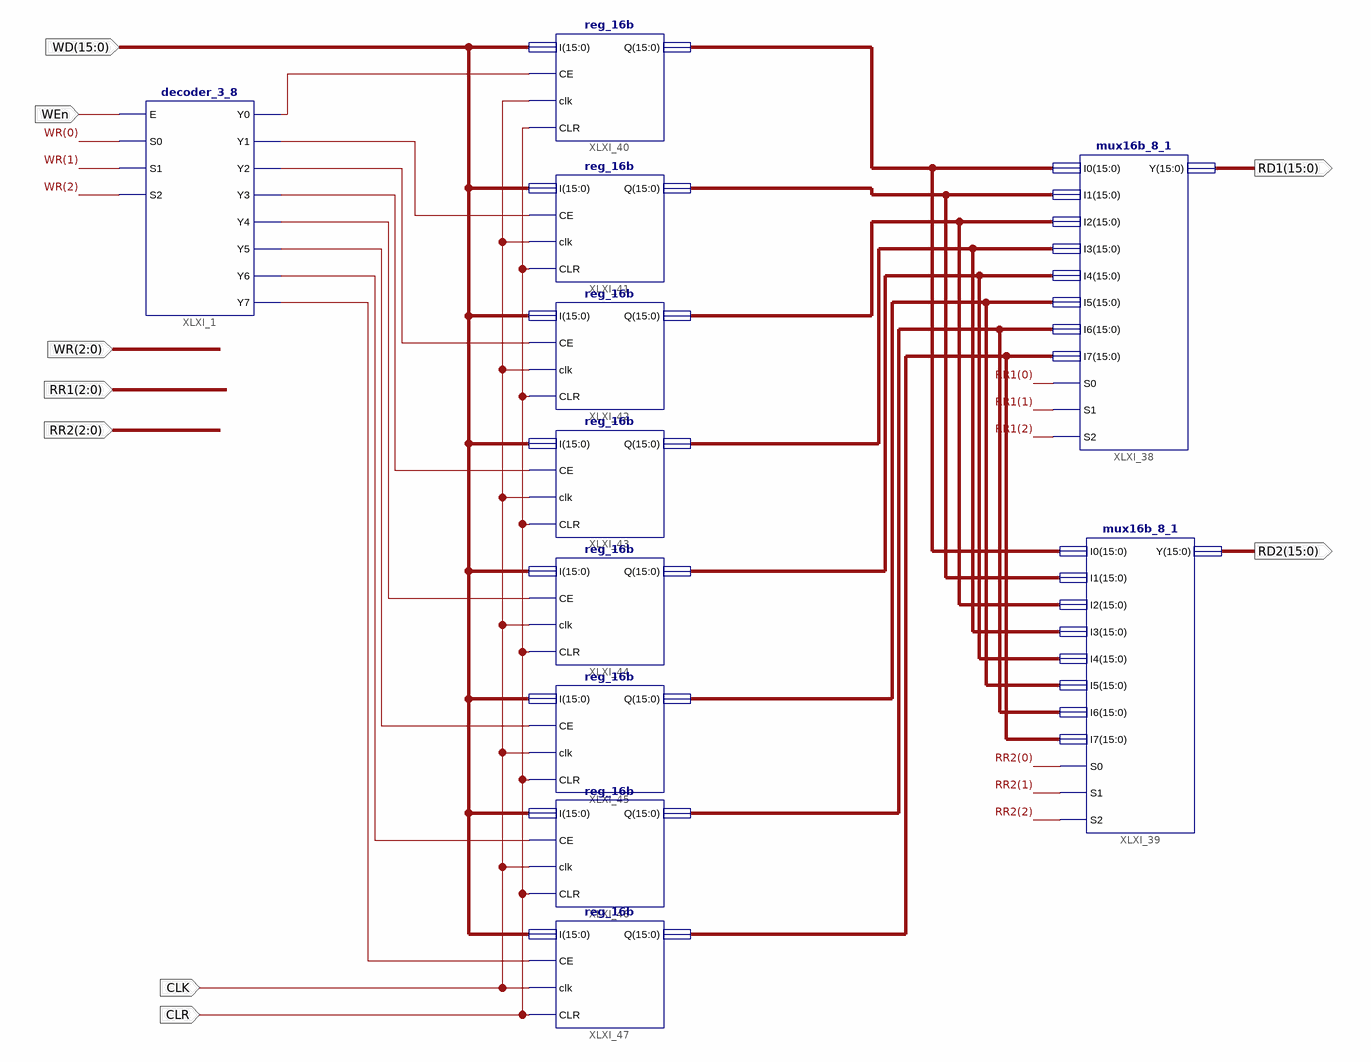
[diagram p0: schematic sheet 1]
// Xilinx ISE schematic RF.sch (artix7) as structural Verilog: 11 symbols, 9 ports
module RF (
  input  [15:0] WD,
  input  CLK,
  input  WEn,
  input  [2:0] WR,
  input  [2:0] RR1,
  input  [2:0] RR2,
  input  CLR,
  output [15:0] RD1,
  output [15:0] RD2
);

  wire XLXN_1, XLXN_2, XLXN_3, XLXN_4, XLXN_5, XLXN_9, XLXN_10, XLXN_11;
  wire [15:0] XLXN_28, XLXN_29, XLXN_30, XLXN_32, XLXN_33, XLXN_34, XLXN_35, XLXN_45;

  decoder_3_8 XLXI_1 (
    .E(WEn), .S0(WR[0]), .S1(WR[1]), .S2(WR[2]), .Y0(XLXN_1), .Y1(XLXN_2), .Y2(XLXN_3), .Y3(XLXN_4),
    .Y4(XLXN_5), .Y5(XLXN_9), .Y6(XLXN_10), .Y7(XLXN_11));
  mux16b_8_1 XLXI_38 (
    .I0(XLXN_28), .I1(XLXN_29), .I2(XLXN_30), .I3(XLXN_45), .I4(XLXN_32), .I5(XLXN_33), .I6(XLXN_34),
    .I7(XLXN_35), .S0(RR1[0]), .S1(RR1[1]), .S2(RR1[2]), .Y(RD1));
  mux16b_8_1 XLXI_39 (
    .I0(XLXN_28), .I1(XLXN_29), .I2(XLXN_30), .I3(XLXN_45), .I4(XLXN_32), .I5(XLXN_33), .I6(XLXN_34),
    .I7(XLXN_35), .S0(RR2[0]), .S1(RR2[1]), .S2(RR2[2]), .Y(RD2));
  reg_16b XLXI_40 (.CE(XLXN_1), .clk(CLK), .CLR(CLR), .I(WD), .Q(XLXN_28));
  reg_16b XLXI_41 (.CE(XLXN_2), .clk(CLK), .CLR(CLR), .I(WD), .Q(XLXN_29));
  reg_16b XLXI_42 (.CE(XLXN_3), .clk(CLK), .CLR(CLR), .I(WD), .Q(XLXN_30));
  reg_16b XLXI_43 (.CE(XLXN_4), .clk(CLK), .CLR(CLR), .I(WD), .Q(XLXN_45));
  reg_16b XLXI_44 (.CE(XLXN_5), .clk(CLK), .CLR(CLR), .I(WD), .Q(XLXN_32));
  reg_16b XLXI_45 (.CE(XLXN_9), .clk(CLK), .CLR(CLR), .I(WD), .Q(XLXN_33));
  reg_16b XLXI_46 (.CE(XLXN_10), .clk(CLK), .CLR(CLR), .I(WD), .Q(XLXN_34));
  reg_16b XLXI_47 (.CE(XLXN_11), .clk(CLK), .CLR(CLR), .I(WD), .Q(XLXN_35));
endmodule
